# EAGLE schematic Smart Driver Adapter_backup (EAGLE 9.6.2)
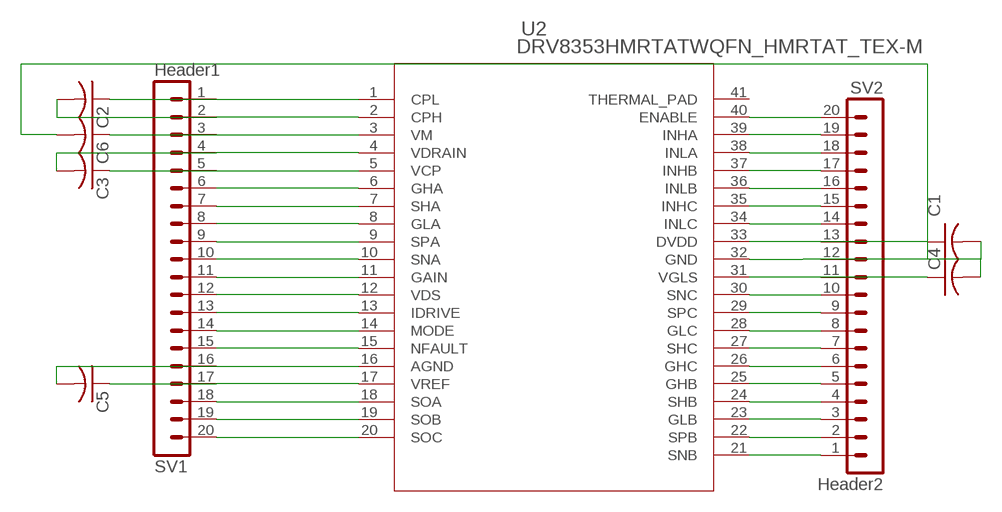
[diagram p0: schematic, sheet 1]

## Parts
C1  C-USC0603K  [C0603K]
C2  C-USC1206K  [C1206K]
C3  C-USC0805K  [C0805K]
C4  C-USC0805K  [C0805K]
C5  C-USC0201  [C0201]
C6  C-USC1206K  [C1206K]
SV1  Header1  MA20-1  [MA20-1]
SV2  Header2  MA20-1  [MA20-1]
U2  DRV8353HMRTATWQFN_HMRTAT_TEX-M  [WQFN_HMRTAT_TEX-M]

## Nets
N$1: C1.1 SV2.13 U2.33(DVDD)
N$2: SV1.14 U2.14(MODE)
N$3: C2.2 SV1.2 U2.2(CPH)
N$4: C6.1 SV1.3 U2.3(VM)
N$5: C3.2 SV1.4 U2.4(VDRAIN)
N$6: C3.1 SV1.5 U2.5(VCP)
N$7: SV1.6 U2.6(GHA)
N$8: SV1.7 U2.7(SHA)
N$9: SV1.8 U2.8(GLA)
N$10: SV1.9 U2.9(SPA)
N$11: SV1.10 U2.10(SNA)
N$12: SV1.11 U2.11(GAIN)
N$13: SV1.13 U2.13(IDRIVE)
N$14: SV1.15 U2.15(NFAULT)
N$15: C5.2 SV1.16 U2.16(AGND)
N$16: C5.1 SV1.17 U2.17(VREF)
N$17: SV1.18 U2.18(SOA)
N$18: SV1.20 U2.20(SOC)
N$19: SV2.20 U2.40(ENABLE)
N$20: SV2.19 U2.39(INHA)
N$21: SV2.18 U2.38(INLA)
N$22: SV2.17 U2.37(INHB)
N$23: SV2.16 U2.36(INLB)
N$24: SV2.15 U2.35(INHC)
N$25: SV2.14 U2.34(INLC)
N$27: C1.2 C4.2 C6.2 SV2.12 U2.32(GND)
N$28: C4.1 SV2.11 U2.31(VGLS)
N$29: SV2.10 U2.30(SNC)
N$30: SV2.9 U2.29(SPC)
N$31: SV2.8 U2.28(GLC)
N$32: SV2.7 U2.27(SHC)
N$33: SV2.6 U2.26(GHC)
N$34: SV2.5 U2.25(GHB)
N$35: SV2.4 U2.24(SHB)
N$36: SV2.3 U2.23(GLB)
N$37: SV2.2 U2.22(SPB)
N$38: SV2.1 U2.21(SNB)
N$39: SV1.12 U2.12(VDS)
N$40: SV1.19 U2.19(SOB)
N$42: C2.1 SV1.1 U2.1(CPL)
Unconnected: U2.41(THERMAL_PAD)

## Library data of the parts
C1-C6 = rcl:C-US: CAPACITOR, American symbol; SPICEPREFIX: C
SV1 SV2 = Modified_Header:MA20-1: PIN HEADER; OC_FARNELL: unknown; OC_NEWARK: unknown
U2 = DRV8353SMRTAT_ModPad:DRV8353HMRTAT; COPYRIGHT: Copyright (C) 2021 Ultra Librarian. All rights reserved.; DIGI-KEY_PART_NUMBER_1: 296-DRV8353HMRTATTR-ND; DIGI-KEY_PART_NUMBER_2: 296-DRV8353HMRTATCT-ND; DIGI-KEY_PART_NUMBER_3: 296-DRV8353HMRTATDKR-ND; MANUFACTURER_PART_NUMBER: DRV8353HMRTAT; MFR_NAME: Texas Instruments